# Altium schematic sheet MCU.SchDoc
size 594 x 420 mm; SheetNumber: 2; SheetTotal: 5
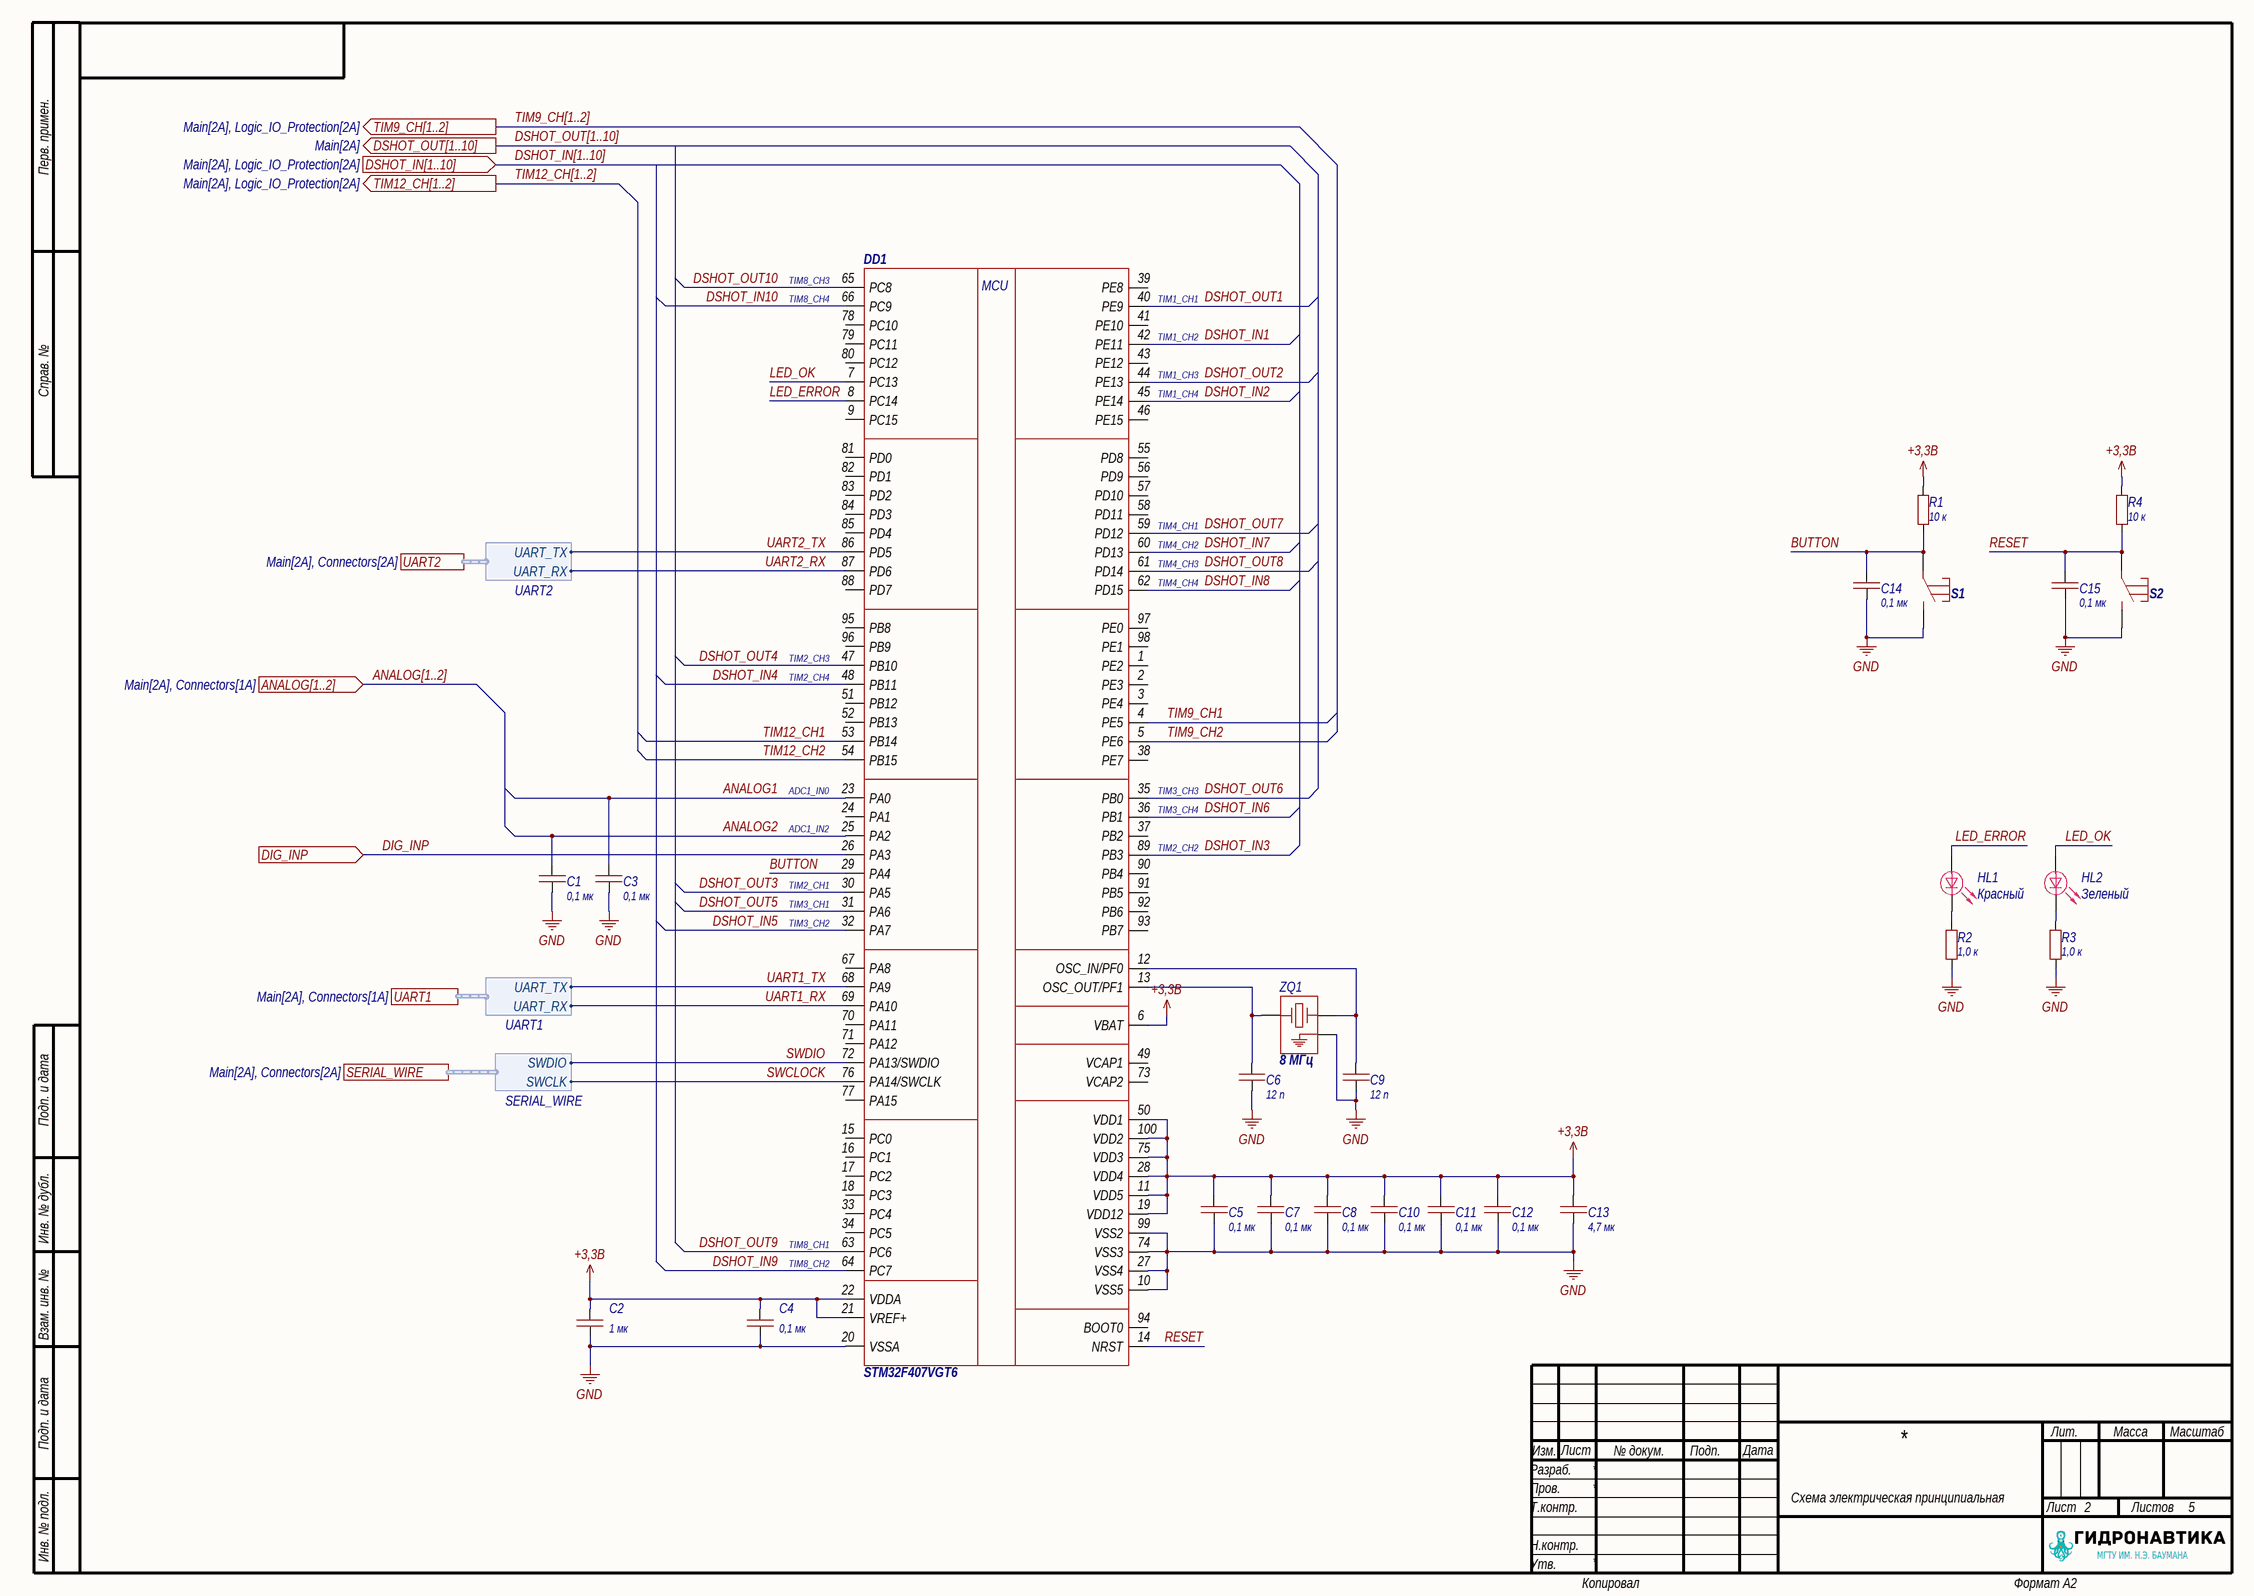
[diagram p0: MCU.SchDoc]

## Parts
C1  value 0,1 мк  [0603C]  (hidden comment: Capacitor)
C2  value 1 мк  [0603C]  (hidden comment: Capacitor)
C3  value 0,1 мк  [0603C]  (hidden comment: Capacitor)
C4  value 0,1 мк  [0603C]  (hidden comment: Capacitor)
C5  value 0,1 мк  [0603C]  (hidden comment: Capacitor)
C6  value 12 п  [0603C]  (hidden comment: Capacitor)
C7  value 0,1 мк  [0603C]  (hidden comment: Capacitor)
C8  value 0,1 мк  [0603C]  (hidden comment: Capacitor)
C9  value 12 п  [0603C]  (hidden comment: Capacitor)
C10  value 0,1 мк  [0603C]  (hidden comment: Capacitor)
C11  value 0,1 мк  [0603C]  (hidden comment: Capacitor)
C12  value 0,1 мк  [0603C]  (hidden comment: Capacitor)
C13  value 4,7 мк  [1206C]  (hidden comment: Capacitor)
C14  value 0,1 мк  [0603C]  (hidden comment: Capacitor)
C15  value 0,1 мк  [0603C]  (hidden comment: Capacitor)
DD1  STM32F407VGT6  [LQFP100]
HL1  Color: Красный  [0805D]  (hidden comment: LED)
HL2  Color: Зеленый  [0805D]  (hidden comment: LED)
R1  value 10 к  [0603R]  (hidden comment: Resistor)
R2  value 1,0 к  [0603R]  (hidden comment: Resistor)
R3  value 1,0 к  [0603R]  (hidden comment: Resistor)
R4  value 10 к  [0603R]  (hidden comment: Resistor)
S1  TSS-TD-19XA-XTR  [TSS-TD-19XA-XTR]  (value not drawn)
S2  TSS-TD-19XA-XTR  [TSS-TD-19XA-XTR]  (value not drawn)
ZQ1  value 8 МГц  [QSMD3.2x2.5]  (hidden comment: XTAL_GND)

## Ports
ANALOG[1..2] (in, see Main[2A], Connectors[1A]), DIG_INP (in), DSHOT_IN[1..10] (in, see Main[2A], Logic_IO_Protection[2A]), DSHOT_OUT[1..10] (out, see Main[2A]), SERIAL_WIRE (harness SERIAL_WIRE, see Main[2A], Connectors[2A]), TIM9_CH[1..2] (out, see Main[2A], Logic_IO_Protection[2A]), TIM12_CH[1..2] (out, see Main[2A], Logic_IO_Protection[2A]), UART1 (harness UART1, see Main[2A], Connectors[1A]), UART2 (harness UART2, see Main[2A], Connectors[2A])

## Harnesses
UART1: UART_TX, UART_RX
SERIAL_WIRE: SWDIO, SWCLK
UART2: UART_TX, UART_RX

## Nets
+3,3В: C2.2 C4.2 C5.2 C7.2 C8.2 C10.2 C11.2 C12.2 C13.2 DD1.6(VBAT) DD1.11(VDD5) DD1.19(VDD12) DD1.21(VREF+) DD1.22(VDDA) DD1.28(VDD4) DD1.50(VDD1) DD1.75(VDD3) DD1.100(VDD2) R1.2 R4.2
GND: C1.1 C2.1 C3.1 C4.1 C5.1 C6.1 C7.1 C8.1 C9.1 C10.1 C11.1 C12.1 C13.1 C14.1 C15.1 DD1.10(VSS5) DD1.20(VSSA) DD1.27(VSS4) DD1.74(VSS3) DD1.99(VSS2) R2.1 R3.1 S1.2 S2.2 ZQ1.3
ANALOG1: C3.2 DD1.23(PA0)
ANALOG2: C1.2 DD1.25(PA2)
BUTTON: C14.2 DD1.29(PA4) R1.1 S1.1
DIG_INP: DD1.26(PA3) ; port DIG_INP
DSHOT_IN1: DD1.42(PE11)
DSHOT_IN2: DD1.45(PE14)
DSHOT_IN3: DD1.89(PB3)
DSHOT_IN4: DD1.48(PB11)
DSHOT_IN5: DD1.32(PA7)
DSHOT_IN6: DD1.36(PB1)
DSHOT_IN7: DD1.60(PD13)
DSHOT_IN8: DD1.62(PD15)
DSHOT_IN9: DD1.64(PC7)
DSHOT_IN10: DD1.66(PC9)
DSHOT_OUT1: DD1.40(PE9)
DSHOT_OUT2: DD1.44(PE13)
DSHOT_OUT3: DD1.30(PA5)
DSHOT_OUT4: DD1.47(PB10)
DSHOT_OUT5: DD1.31(PA6)
DSHOT_OUT6: DD1.35(PB0)
DSHOT_OUT7: DD1.59(PD12)
DSHOT_OUT8: DD1.61(PD14)
DSHOT_OUT9: DD1.63(PC6)
DSHOT_OUT10: DD1.65(PC8)
LED_ERROR: DD1.8(PC14) HL1.1
LED_OK: DD1.7(PC13) HL2.1
RESET: C15.2 DD1.14(NRST) R4.1 S2.1
SWCLOCK: DD1.76(PA14/SWCLK) ; port SERIAL_WIRE.SWCLK
SWDIO: DD1.72(PA13/SWDIO) ; port SERIAL_WIRE.SWDIO
TIM9_CH1: DD1.4(PE5)
TIM9_CH2: DD1.5(PE6)
TIM12_CH1: DD1.53(PB14)
TIM12_CH2: DD1.54(PB15)
UART1_RX: DD1.69(PA10) ; port UART1.UART_RX
UART1_TX: DD1.68(PA9) ; port UART1.UART_TX
UART2_RX: DD1.87(PD6) ; port UART2.UART_RX
UART2_TX: DD1.86(PD5) ; port UART2.UART_TX
NetC6_2: C6.2 DD1.13(OSC_OUT/PF1) ZQ1.1
NetC9_2: C9.2 DD1.12(OSC_IN/PF0) ZQ1.2
NetHL1_2: HL1.2 R2.2
NetHL2_2: HL2.2 R3.2

Not connected (* = marked no-connect by the designer): DD1 1(PE2) 2(PE3) 3(PE4) 9(PC15) 15(PC0) 16(PC1) 17(PC2) 18(PC3) 24(PA1) 33(PC4) 34(PC5) 37(PB2) 38(PE7) 39(PE8) 41(PE10) 43(PE12) 46(PE15) 49(VCAP1) 51(PB12) 52(PB13) 55(PD8) 56(PD9) 57(PD10) 58(PD11) 67(PA8) 70(PA11) 71(PA12) 73(VCAP2) 77(PA15) 78(PC10) 79(PC11) 80(PC12) 81(PD0) 82(PD1) 83(PD2) 84(PD3) 85(PD4) 88(PD7) 90(PB4) 91(PB5) 92(PB6) 93(PB7) 94(BOOT0) 95(PB8) 96(PB9) 97(PE0) 98(PE1)

## Buses and harness runs
bus ANALOG[1..2] = port ANALOG[1..2]
bus DSHOT_IN[1..10] = port DSHOT_IN[1..10]
bus DSHOT_OUT[1..10] = port DSHOT_OUT[1..10]
bus TIM9_CH[1..2] = port TIM9_CH[1..2]
bus TIM12_CH[1..2] = port TIM12_CH[1..2]

## Notes on the sheet
- (near DD1) TIM8_CH3
- (near DD1) TIM8_CH4
- (near DD1) TIM1_CH1
- (near DD1) TIM1_CH2
- (near DD1) TIM1_CH3
- (near DD1) TIM1_CH4
- (near DD1) TIM4_CH1
- (near DD1) TIM4_CH2
- (near DD1) TIM4_CH3
- (near DD1) TIM4_CH4
- (near DD1) TIM2_CH3
- (near DD1) TIM2_CH4
- (near DD1) ADC1_IN0
- (near DD1) TIM3_CH3
- (near DD1) ADC1_IN2
- (near DD1) TIM3_CH4
- (near DD1) TIM2_CH1
- (near DD1) TIM2_CH2
- (near DD1) TIM3_CH1
- (near DD1) TIM3_CH2
- (near DD1) TIM8_CH1
- (near DD1) TIM8_CH2
- Перв. примен.
- Справ. №
- Подп. и дата
- Инв. № дубл.
- Взам. инв. №
- Разраб.
- Изм.
- Лист
- № докум.
- Подп.
- Дата
- Лит.
- Масса
- Масштаб
- Пров.
- Т.контр.
- Схема электрическая принципиальная
- Листов
- Инв. № подл.
- Утв.
- Н.контр.
- Копировал
- Формат А2
- (in symbol STM32F407VGT6) MCU

## Library data of the parts
C1 C3-C5 C7 C8 C10-C12 C14 C15 = Capacitor_0,1u_10_50V_X7R_0603C: Конденсатор; Library Path2: Schematic\Capacitor.SchLib; Tolerance: 0,1; Voltage (V): 50; Dielectric: X7R; Capacity (nF): 100; Part Number: Capacitor_0,1u_10_50V_X7R_0603C
C2 = Capacitor_1u_10_50V_X7R_0603C: Конденсатор; Library Path2: Schematic\Capacitor.SchLib; Tolerance: 0,1; Voltage (V): 50; Dielectric: X7R; Capacity (nF): 1000; Part Number: Capacitor_1u_10_50V_X7R_0603C
C6 C9 = 0,1 мк: Конденсатор 12п; Part Number: Capacitor
C13 = Capacitor_4,7u_10_50V_X7R_1206C: Конденсатор; Library Path2: Schematic\Capacitor.SchLib; Tolerance: 0,1; Voltage (V): 50; Dielectric: X7R; Capacity (nF): 4700; Part Number: Capacitor_4,7u_10_50V_X7R_1206C
DD1 = STM32F407VGT6: Микроконтроллер; Part Number: STM32F407VGT6
HL1 HL2 = LED: Светодиод; Part Number: LED
R1 R4 = Resistor_10k_1_0603: Резистор номиналом 10 кОм и точностью 1%; Power: *; Part Number: Resistor_10k_1_0603; Tolerance: 1%
R2 R3 = Resistor_1.0k_1_0603: Резистор номиналом 1,0 кОм и точностью 1%; Power: *; Part Number: Resistor_1.0k_1_0603; Tolerance: 1%
S1 S2 = TSS-TD-19XA-XTR: Тактовая кнопка; Part Number: TSS-TD-19XA-XTR
ZQ1 = XTAL_GND: Кварцевый резонатор с входом земли; Part Number: XTAL_GND